# Altium schematic sheet Schematic.SchDoc
size A4; SheetNumber: 1; SheetTotal: 1
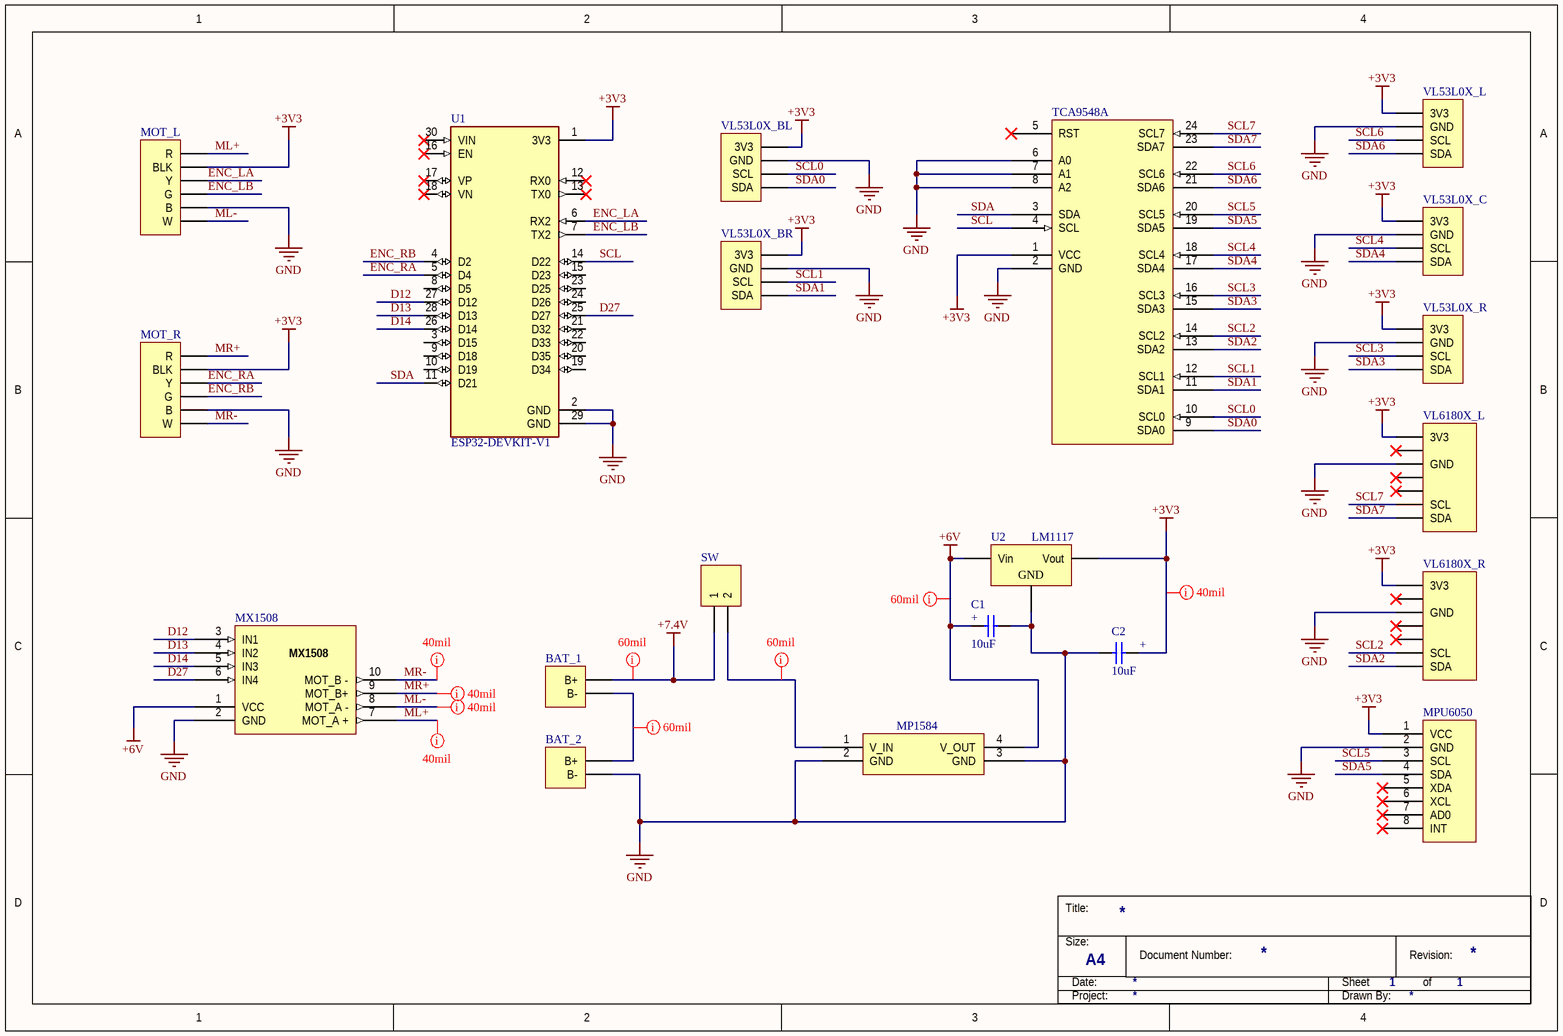
[diagram p0: Schematic.SchDoc]

## Parts
BAT_1  Header 2  [MY_6410-02]  (value not drawn)
BAT_2  Header 2  [MY_6410-02]  (value not drawn)
C1  10uF  [MY_E2.5-5mm]
C2  10uF  [MY_E2.5-5mm]
MOT_L  Header 6  [MY_53253-0670]  (value not drawn)
MOT_R  Header 6  [MY_53253-0670]  (value not drawn)
MP1584  MP1584 Mini Adjustable Buck  [MP1584 Mini Adjustable Buck-Footprint-1]  (value not drawn)
MPU6050  MPU6050 Accelerometer and Gyroscope Sensor  [MPU6050 Accelerometer and Gyroscope Sensor-Footprint-1]  (value not drawn)
MX1508  MX1508 Motor Driver  [MX1508 Motor Driver-Footprint-1]  (value not drawn)
SW  Header 2  [MY_6410-02]  (value not drawn)
TCA9548A  TCA9548A 1-to-8 I2C Multiplexer Module  [TCA9548A 1-to-8 I2C Multiplexer Module-Footprint-1]  (value not drawn)
U1  ESP32-DEVKIT-V1  [MODULE_ESP32_DEVKIT_V1]
U2  LM1117  [MY_SOT223]
VL53L0X_BL  Header 4  [MY_MA04-1W]  (value not drawn)
VL53L0X_BR  Header 4  [MY_MA04-1W]  (value not drawn)
VL53L0X_C  Header 4  [MY_MA04-1W]  (value not drawn)
VL53L0X_L  Header 4  [MY_MA04-1W]  (value not drawn)
VL53L0X_R  Header 4  [MY_MA04-1W]  (value not drawn)
VL6180X_L  Header 7  [MY_MA07-1W]  (value not drawn)
VL6180X_R  Header 7  [MY_MA07-1W]  (value not drawn)

## Nets
+3V3: C2.+ MOT_L.2(BLK) MOT_R.2(BLK) MPU6050.1(VCC) TCA9548A.1(VCC) U1.1(3V3) U2.2(Vout) VL53L0X_BL.1(3V3) VL53L0X_BR.1(3V3) VL53L0X_C.1(3V3) VL53L0X_L.1(3V3) VL53L0X_R.1(3V3) VL6180X_L.1(3V3) VL6180X_R.1(3V3)
+6V: C1.+ MP1584.4(V_OUT) MX1508.1(VCC) U2.3(Vin)
+7.4V: BAT_1.1(B+) SW.1
GND: BAT_2.2(B-) C1.- C2.- MOT_L.5(B) MOT_R.5(B) MP1584.2(GND) MP1584.3(GND) MPU6050.2(GND) MX1508.2(GND) TCA9548A.2(GND) TCA9548A.6(A0) TCA9548A.7(A1) TCA9548A.8(A2) U1.2(GND) U1.29(GND) U2.1(GND) VL53L0X_BL.2(GND) VL53L0X_BR.2(GND) VL53L0X_C.2(GND) VL53L0X_L.2(GND) VL53L0X_R.2(GND) VL6180X_L.3(GND) VL6180X_R.3(GND)
D12: MX1508.3(IN1) U1.27(D12)
D13: MX1508.4(IN2) U1.28(D13)
D14: MX1508.5(IN3) U1.26(D14)
D27: MX1508.6(IN4) U1.25(D27)
ENC_LA: MOT_L.3(Y) U1.6(RX2)
ENC_LB: MOT_L.4(G) U1.7(TX2)
ENC_RA: MOT_R.3(Y) U1.5(D4)
ENC_RB: MOT_R.4(G) U1.4(D2)
ML+: MOT_L.1(R) MX1508.7(MOT_A_+)
ML-: MOT_L.6(W) MX1508.8(MOT_A_-)
MR+: MOT_R.1(R) MX1508.9(MOT_B+)
MR-: MOT_R.6(W) MX1508.10(MOT_B_-)
SCL: TCA9548A.4(SCL) U1.14(D22)
SCL0: TCA9548A.10(SCL0) VL53L0X_BL.3(SCL)
SCL1: TCA9548A.12(SCL1) VL53L0X_BR.3(SCL)
SCL2: TCA9548A.14(SCL2) VL6180X_R.6(SCL)
SCL3: TCA9548A.16(SCL3) VL53L0X_R.3(SCL)
SCL4: TCA9548A.18(SCL4) VL53L0X_C.3(SCL)
SCL5: MPU6050.3(SCL) TCA9548A.20(SCL5)
SCL6: TCA9548A.22(SCL6) VL53L0X_L.3(SCL)
SCL7: TCA9548A.24(SCL7) VL6180X_L.6(SCL)
SDA: TCA9548A.3(SDA) U1.11(D21)
SDA0: TCA9548A.9(SDA0) VL53L0X_BL.4(SDA)
SDA1: TCA9548A.11(SDA1) VL53L0X_BR.4(SDA)
SDA2: TCA9548A.13(SDA2) VL6180X_R.7(SDA)
SDA3: TCA9548A.15(SDA3) VL53L0X_R.4(SDA)
SDA4: TCA9548A.17(SDA4) VL53L0X_C.4(SDA)
SDA5: MPU6050.4(SDA) TCA9548A.19(SDA5)
SDA6: TCA9548A.21(SDA6) VL53L0X_L.4(SDA)
SDA7: TCA9548A.23(SDA7) VL6180X_L.7(SDA)
NetBAT_1_2: BAT_1.2(B-) BAT_2.1(B+)
NetMP1584_1: MP1584.1(V_IN) SW.2

Not connected (* = marked no-connect by the designer): MPU6050 5(XDA)* 6(XCL)* 7(AD0)* 8(INT)*; TCA9548A 5(RST)*; U1 3(D15) 8(D5) 9(D18) 10(D19) 12(RX0)* 13(TX0)* 15(D23) 16(EN)* 17(VP)* 18(VN)* 19(D34) 20(D35) 21(D32) 22(D33) 23(D25) 24(D26) 30(VIN)*; VL6180X_L 2* 4* 5*; VL6180X_R 2* 4* 5*

## Layout directives
rule Width Constraint [Pref Width = 40mil    Min Width = 40mil    Max Width = 40mil]: +3V3, ML+, ML-, MR+, MR-
rule Width Constraint [Pref Width = 60mil    Min Width = 60mil    Max Width = 60mil]: +6V, +7.4V, NetBAT_1_2, NetMP1584_1

## Notes on the sheet
- Title:
- Size:
- Date:
- A4
- Document Number:
- Sheet
- Revision:
- of
- Project:
- Drawn By:

## Library data of the parts
BAT_1 BAT_2 SW = Header 2: Header, 2-Pin; ASiD Part Number: Header 2-AS
C1 C2 = Cap Pol: Polar capacitor; ASiD Part Number: C-AS; Volte: 25v; Value: 10uF
MOT_L MOT_R = Header 6: Header, 6-Pin; ASiD Part Number: Header 6-AS
MP1584 = RBT-0002-2: MP1584 Mini Adjustable DC-DC Step Down Module can step-down a 4.5 to 28V input voltage to a 0.8 to 20V output at up to 2A.
MPU6050 = RBT-0003-2: MPU6050 sensor module is complete 6-axis Motion Tracking Device. It combines 3-axis Gyroscope, 3-axis Accelerometer and Digital Motion Processor all in small package.
MX1508 = RBT-0001-2: MX1508 Dual H Bridge DC PWM Stepper Motor Driver module.
TCA9548A = RBT-0004-4: An 8-channel I2C multiplexer which is useful to allow multiple I2C devices with the same address to share a single I2C bus.
U1 = ESP32-DEVKIT-V1: Dual core, Wi-Fi: 2.4 GHz up to 150 Mbits/s,BLE (Bluetooth Low Energy) and legacy Bluetooth, 32 bits, Up to 240 MHz; MF: {'manufacturer': u'Do it'}; Package: None; Price: None; Value: *; MP: ESP32-DEVKIT-V1; Availability: Unavailable
U2 = LM1117: Low Drop Voltage Reg; ASiD Part Number: LM1117-AS
VL53L0X_BL VL53L0X_BR VL53L0X_C VL53L0X_L VL53L0X_R = Header 4: Header, 4-Pin; ASiD Part Number: Header 4-AS
VL6180X_L VL6180X_R = Header 7: Header, 8-Pin, Dual row; ASiD Part Number: Header 7-AS